# EAGLE design ASARUM-S300CO2toGROVE (EAGLE 7.7.0)
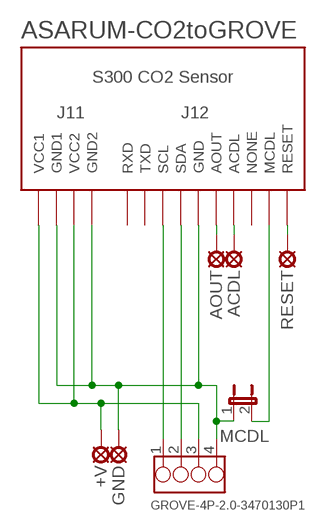
[diagram p0: schematic, sheet 1]

## Parts
+V  LSP10  [LSP10]
ACDL  LSP10  [LSP10]
AOUT  LSP10  [LSP10]
GND  LSP10  [LSP10]
GROVE_I2C  GROVE-4P-2.0-3470130P1  [4P-2.0]
MCDL  JP1E  [JP1]
RESET  LSP10  [LSP10]
S300  S300  [S300REV]

## Nets
GND [GND]: GND.MP GROVE_I2C.4 MCDL.1 S300.J11P$2_GND(GND1) S300.J11P$4_GND(GND2) S300.J12P$5_GND(GND)
N$1: GROVE_I2C.1 S300.J12P$3_SCL(SCL)
N$2: GROVE_I2C.2 S300.J12P$4_SDA(SDA)
N$5: MCDL.2 S300.J12P$9_MCDL(MCDL)
N$6: RESET.MP S300.J12P$10_RESET(RESET)
N$7: ACDL.MP S300.J12P$7_ACDL(ACDL)
N$8: AOUT.MP S300.J12P$6_AOUT(AOUT)
VCC [+5V]: +V.MP GROVE_I2C.3 S300.J11P$1_VCC(VCC1) S300.J11P$3_VCC(VCC2)
Unconnected: S300.J12P$1_RXD(RXD) S300.J12P$2_TXD(TXD) S300.J12P$8_NONE(NONE)

## Notes on the sheet
- ASARUM-CO2toGROVE

## Library data of the parts
+V ACDL AOUT GND RESET = solpad:LSP10: SOLDER PAD drill 1.0 mm, distributor Buerklin, 12H555
GROVE_I2C = GroveConnector:GROVE-4P-2.0
MCDL = jumper:JP1E: JUMPER
S300 = _CO2Sensor:S300

## Net classes
0 default: width 0.3 mm, clearance 0.24 mm
1 GND: width 1.2 mm, drill 1 mm, clearance 0.24 mm
2 +5V: width 1.2 mm, drill 0.8 mm, clearance 0.24 mm
3 +12V: width 1 mm, drill 1 mm, clearance 0.5 mm
4 signal: clearance 0.24 mm
5 +3.3V: width 0.5 mm, drill 0.4 mm, clearance 0.24 mm
6 OPC: width 0.6 mm, drill 0.5 mm

## Board
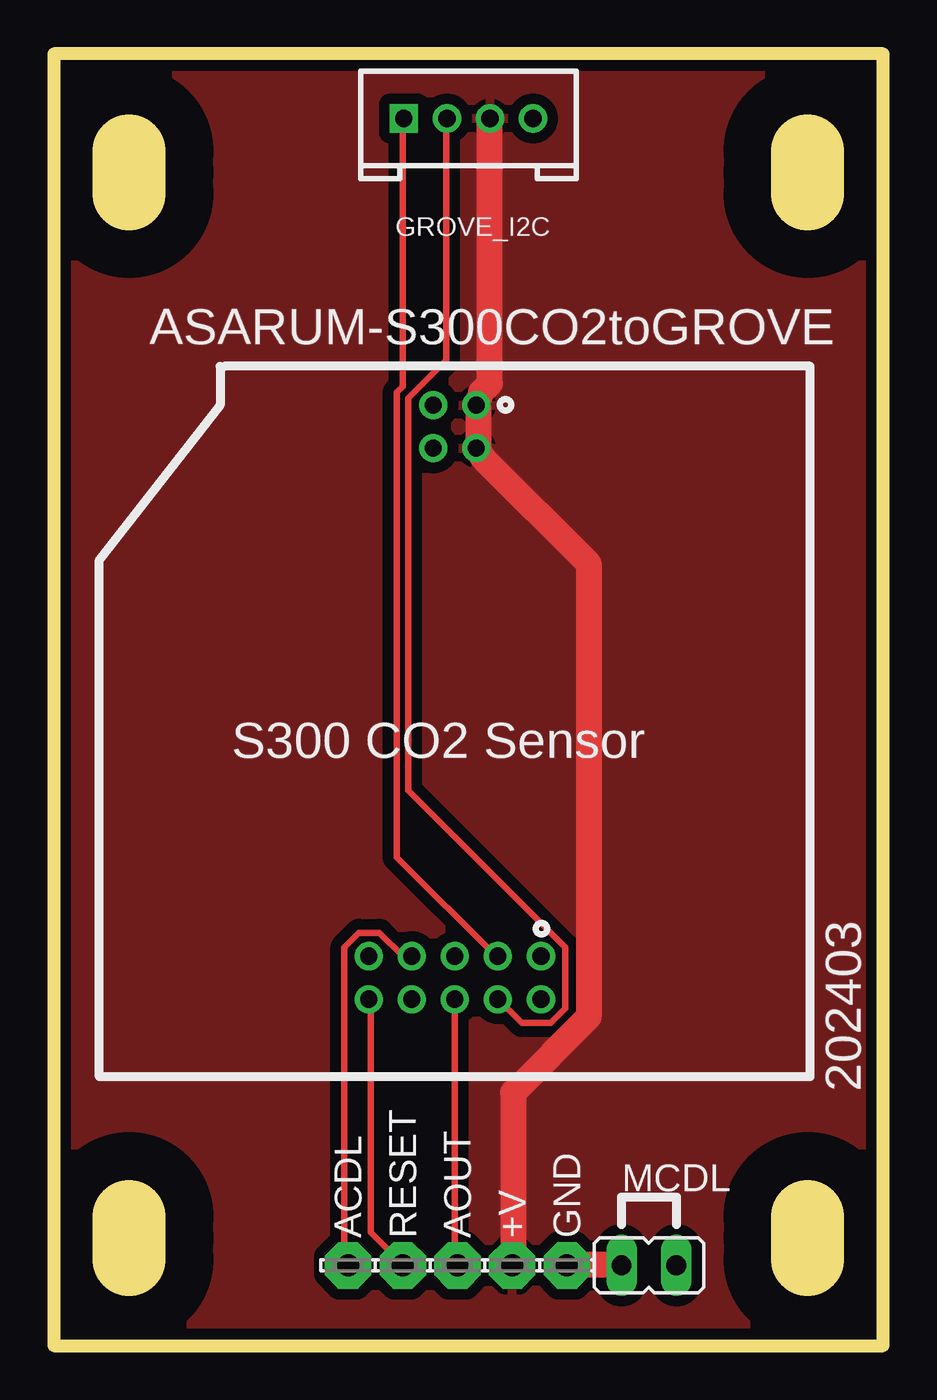
[diagram p1: board, top side]
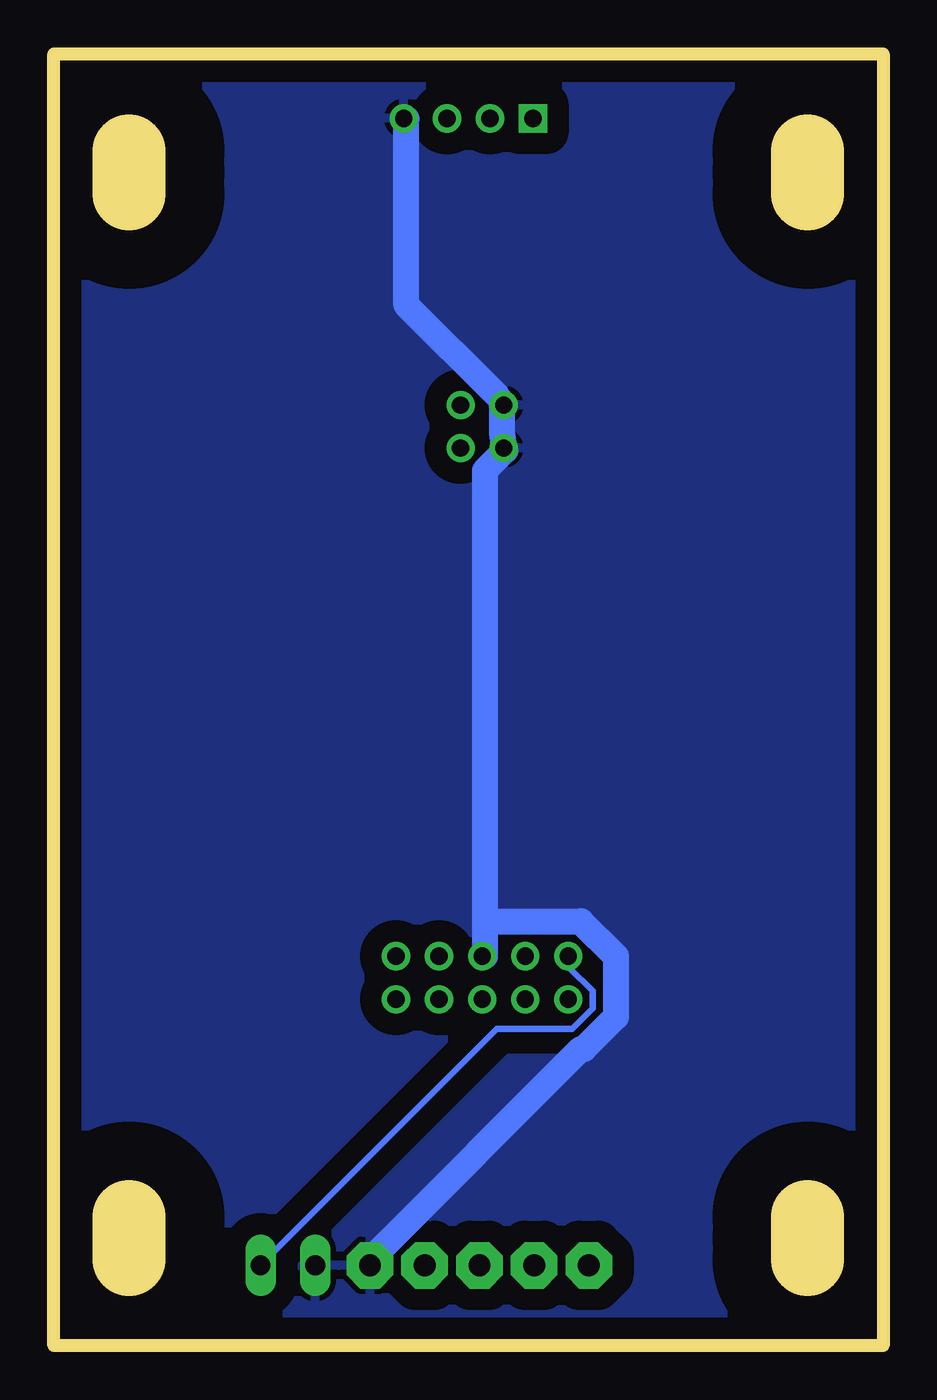
[diagram p2: board, bottom side, seen from below]

Size 38.5 x 60 mm. Coordinates in mm from the lower left corner, seen from the top.
Outline: 38.5,60 0,60 0,0 38.5,0 38.5,60
Copper layers (1*16): Top 0.035mm / dielectric 1.5mm / Bottom 0.035mm
Design rules "ssci_SeeedStudio_2layer_DRU_no_angle *": minimum track width 6mil, minimum drill 12mil, track to track 6mil, track to pad 6mil, pad to pad 6mil, via to via 1mm, smd to smd 0mil, copper to edge 10mil, drill to drill 10mil, minimum pad ring 10mil, minimum via ring 6mil, stop-mask expansion 2mil, vias tented up to drill 25mil, thermal gap 10mil
tRestrict: area 0.3,51.3 to 6.7,57.7; area 31.8,51.3 to 38.2,57.7; area 31.8,0.8 to 38.2,7.2; area 31.8,2.8 to 38.2,9.2; area 31.8,1.8 to 38.2,8.2; area 0.3,50.3 to 6.7,56.7; area 0.3,52.3 to 6.7,58.7; area 31.8,50.3 to 38.2,56.7; area 31.8,52.3 to 38.2,58.7; area 0.3,0.8 to 6.7,7.2; area 0.3,2.8 to 6.7,9.2; area 0.3,1.8 to 6.7,8.2
bRestrict: area 0.3,51.3 to 6.7,57.7; area 31.8,51.3 to 38.2,57.7; area 31.8,0.8 to 38.2,7.2; area 31.8,1.8 to 38.2,8.2; area 31.8,2.8 to 38.2,9.2; area 0.3,52.3 to 6.7,58.7; area 0.3,50.3 to 6.7,56.7; area 31.8,52.3 to 38.2,58.7; area 31.8,50.3 to 38.2,56.7; area 0.3,0.8 to 6.7,7.2; area 0.3,1.8 to 6.7,8.2; area 0.3,2.8 to 6.7,9.2
Milling: 4 lines

### Footprints (pad centres in the part's own frame; a part is rotated, then mirrored left to right if it is on the bottom)
LSP10 = drill 1.016 pad 2.159 octagon: MP 0,0
4P-2.0 = drill 0.8 pad 1.27 square: 1 -3,0 | drill 0.8 pad 1.27: 2 -1,0; 3 1,0; 4 3,0
JP1 = drill 0.914 long: 1 0,-1.27; 2 0,1.27
S300REV = drill 0.8: J11P$1_VCC 17.5,31.2; J11P$2_GND 15.5,31.2; J11P$3_VCC 17.5,29.2; J11P$4_GND 15.5,29.2; J12P$1_RXD 20.5,5.6; J12P$2_TXD 20.5,3.6; J12P$3_SCL 18.5,5.6; J12P$4_SDA 18.5,3.6; J12P$5_GND 16.5,5.6; J12P$6_AOUT 16.5,3.6; J12P$7_ACDL 14.5,5.6; J12P$8_NONE 14.5,3.6; J12P$9_MCDL 12.5,5.6; J12P$10_RESET 12.5,3.6

### Placement (x,y rotation side)
+V  21.28,3.73 0 top
ACDL  13.66,3.73 0 top
AOUT  18.74,3.73 0 top
GND  23.82,3.73 0 top
GROVE_I2C  19.25,57 0 top
MCDL  27.63,3.73 270 top
RESET  16.2,3.73 0 top
S300  2.12,12.49 0 top

### Tracks (layer width: path | path; a pad name or v marks a point on that pad's centre or on a via)
GND
  Top 1.2: MCDL.1 26.32,3.79 23.89,3.79 GND.MP
  Bottom 1.2: 18.48,19.71 18.48,40.64 17.54,41.59 S300.J11P$4_GND 17.68,42.26 17.68,43.61 S300.J11P$2_GND 17.95,44.15 22.13,48.34 22.13,56.98 GROVE_I2C.4 | 18.48,19.71 18.48,18.09 S300.J12P$5_GND | 18.48,19.71 14.03,19.71 12.41,18.09 12.41,15.26 13.89,13.78 14.03,13.78 23.75,4.05 23.75,3.79 GND.MP
  pour Bottom (isolate 1): -1.5,62 40.5,62 40.5,-2 -1.5,-2
N$1
  Top 0.3: GROVE_I2C.1 16.19,56.98 16.19,44.55 15.92,44.28 15.92,22.68 20.51,18.09 S300.J12P$3_SCL
N$2
  Top 0.3: GROVE_I2C.2 18.21,56.98 18.21,45.77 16.46,44.02 16.46,25.79 23.75,18.5 23.75,15.66 23.07,14.99 21.73,14.99 20.64,16.07 S300.J12P$4_SDA
N$5
  Bottom 0.3: S300.J12P$9_MCDL 14.57,17.96 14.57,17.55 13.49,16.48 13.49,15.66 14.44,14.72 17.95,14.72 28.88,3.79 MCDL.2
N$6
  Top 0.3: S300.J12P$10_RESET 14.71,16.07 14.71,5.27 16.19,3.79 RESET.MP
N$7
  Top 0.3: S300.J12P$7_ACDL 16.59,18.09 16.19,18.09 15.11,19.18 14.16,19.18 13.49,18.5 13.49,3.92 13.62,3.79 ACDL.MP
N$8
  Top 0.3: S300.J12P$6_AOUT 18.62,16.07 18.62,3.79 AOUT.MP
VCC
  Top 1.2: GROVE_I2C.3 20.24,56.98 20.24,44.69 19.84,44.28 S300.J11P$1_VCC 19.7,43.61 19.7,41.72 S300.J11P$3_VCC 19.97,41.18 24.83,36.32 24.83,15.26 21.32,11.75 21.32,3.79 +V.MP
  pour Top (isolate 0.5): -2.5,63 41.5,63 41.5,-3 -2.5,-3

### Text on the board
tPlace: ASARUM-S300CO2toGROVE | S300 CO2 Sensor | 202403
Measures: HOLE IS 3.5mm pitch | suitable to MIRAI KOUGYOU WALL BOX | WB-xD or WB-xDM series